# Altium schematic sheet Mega8515_flasher_v2.SchDoc
size 338 x 116 mm
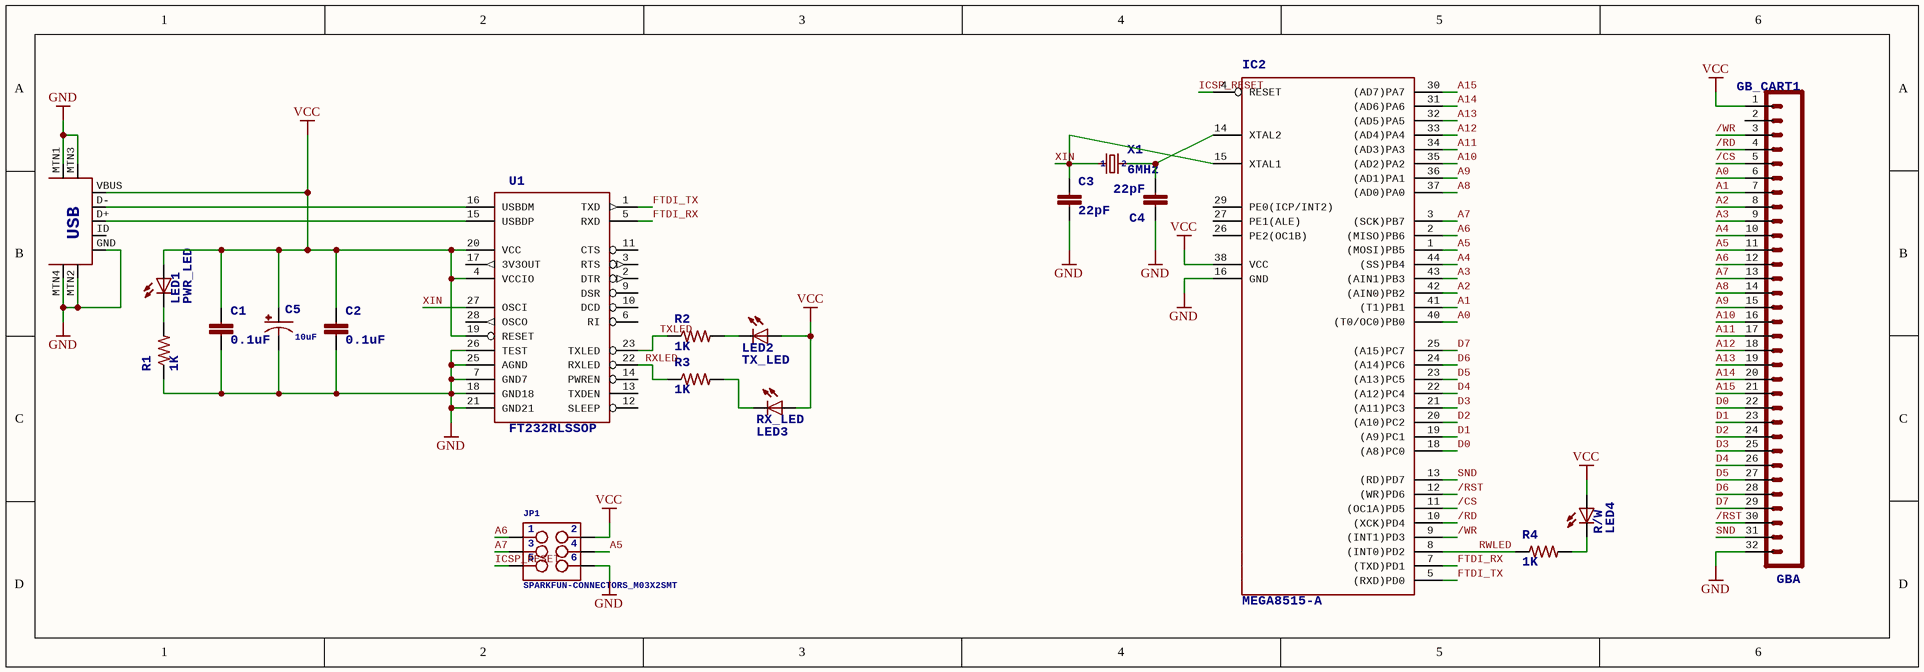
[diagram p0: Mega8515_flasher_v2.SchDoc]

## Parts
C1  >NAME: C1  [0805]  (hidden comment: 0.1uF)
C2  >NAME: C2  [0805]  (hidden comment: 0.1uF)
C3  >NAME: C3  [0805]  (hidden comment: 22pF)
C4  >NAME: C4  [0805]  (hidden comment: 22pF)
C5  >NAME: C5  [EIA3216]  (hidden comment: 10uF)
GBA  >NAME: GBA  [GB_CART_1]  (hidden comment: GB_CART1)
IC2  >NAME: IC2  [TQFP44]  (hidden comment: MEGA8515-A)
JP1  >NAME: JP1  [HDR2X3]  (hidden comment: SPARKFUN-CONNECTORS_M03X2SMT)
LED1  >NAME: LED1  [LED-1206]  (hidden comment: PWR_LED)
LED2  >NAME: LED2  [LED-1206]  (hidden comment: TX_LED)
R1  >NAME: R1  [0805]  (hidden comment: 1K)
R2  >NAME: R2  [0805]  (hidden comment: 1K)
R3  >NAME: R3  [0805]  (hidden comment: 1K)
R4  >NAME: R4  [0805]  (hidden comment: 1K)
R/W  >NAME: R/W  [LED-1206]  (hidden comment: LED4)
RX_LED  >NAME: RX_LED  [LED-1206]  (hidden comment: LED3)
U1  >NAME: U1  [SSOP28DB]  (hidden comment: FT232RLSSOP)
USB  USB-MINIB-5PIN  [USB-MINIB]  (value not drawn)
X1  >NAME: X1  [5032]  (hidden comment: 6MHz)

## Nets
GND: C1.2 C2.2 C3.2 C4.1 C5.C(-) GBA.32 IC2.16(GND) JP1.6 R1.1 U1.7(GND7) U1.18(GND18) U1.21(GND21) U1.25(AGND) U1.26(TEST) USB.GND USB.MTN1(MTN2) USB.MTN2(MTN3) USB.MTN3(MTN1) USB.MTN4
VCC: C1.1 C2.1 C5.A(+) GBA.1 IC2.38(VCC) JP1.2 LED1.A LED2.A R/W.A RX_LED.A U1.4(VCCIO) U1.19(RESET) U1.20(VCC) USB.VBUS
/CS: GBA.5 IC2.11((OC1A)PD5)
/RD: GBA.4 IC2.10((XCK)PD4)
/RST: GBA.30 IC2.12((WR)PD6)
/WR: GBA.3 IC2.9((INT1)PD3)
A0: GBA.6 IC2.40((T0/OC0)PB0)
A1: GBA.7 IC2.41((T1)PB1)
A2: GBA.8 IC2.42((AIN0)PB2)
A3: GBA.9 IC2.43((AIN1)PB3)
A4: GBA.10 IC2.44((SS)PB4)
A5: GBA.11 IC2.1((MOSI)PB5) JP1.4
A6: GBA.12 IC2.2((MISO)PB6) JP1.1
A7: GBA.13 IC2.3((SCK)PB7) JP1.3
A8: GBA.14 IC2.37((AD0)PA0)
A9: GBA.15 IC2.36((AD1)PA1)
A10: GBA.16 IC2.35((AD2)PA2)
A11: GBA.17 IC2.34((AD3)PA3)
A12: GBA.18 IC2.33((AD4)PA4)
A13: GBA.19 IC2.32((AD5)PA5)
A14: GBA.20 IC2.31((AD6)PA6)
A15: GBA.21 IC2.30((AD7)PA7)
D0: GBA.22 IC2.18((A8)PC0)
D1: GBA.23 IC2.19((A9)PC1)
D2: GBA.24 IC2.20((A10)PC2)
D3: GBA.25 IC2.21((A11)PC3)
D4: GBA.26 IC2.22((A12)PC4)
D5: GBA.27 IC2.23((A13)PC5)
D6: GBA.28 IC2.24((A14)PC6)
D7: GBA.29 IC2.25((A15)PC7)
FTDI_RX: IC2.7((TXD)PD1) U1.5(RXD)
FTDI_TX: IC2.5((RXD)PD0) U1.1(TXD)
ICSP_RESET: IC2.4(RESET) JP1.5
RWLED: IC2.8((INT0)PD2) R4.1
RXLED: R3.1 U1.22(RXLED)
SND: GBA.31 IC2.13((RD)PD7)
TXLED: R2.1 U1.23(TXLED)
XIN: C3.1 IC2.15(XTAL1) U1.27(OSCI) X1.1_4
NetC4_2: C4.2 IC2.14(XTAL2) X1.2_3
NetLED1_C: LED1.C R1.2
NetLED2_C: LED2.C R2.2
NetR3_2: R3.2 RX_LED.C
NetR4_2: R4.2 R/W.C
NetU1_15: U1.15(USBDP) USB.D+
NetU1_16: U1.16(USBDM) USB.D-

Not connected (* = marked no-connect by the designer): GBA 2; IC2 6(NC1) 17(NC2) 26(PE2(OC1B)) 27(PE1(ALE)) 28(NC3) 29(PE0(ICP/INT2)) 39(NC4); U1 2(DTR) 3(RTS) 6(RI) 9(DSR) 10(DCD) 11(CTS) 12(SLEEP) 13(TXDEN) 14(PWREN) 17(3V3OUT) 28(OSCO); USB ID

## Library data of the parts
C1 C2 = CAP1206: <b>Capacitor</b> / Standard 0603 ceramic capacitor, and 0.1" leaded capacitor.; >VALUE: 0.1uF
C3 C4 = CAP0805: <b>Capacitor</b> / Standard 0603 ceramic capacitor, and 0.1" leaded capacitor.; >VALUE: 22pF
C5 = 10UF-TANT: 10uF Tantalum SMT<br> / CAP-00811- 16V 10% (EIA-3216); PROD_ID: CAP-00811; VALUE: 10uF
IC2 = MEGA8515-A: <b>MICROCONTROLLER</b><p> / 8 Kbytes FLASH<br> / 512 bytes SRAM<br> / 512 bytes EEPROM<br> / USART<br> / 8-channel 10 bit ADC<p> / Source: avr.lbr; MPN: ATMEGA8515-16AU; OC_FARNELL: 9171410; OC_NEWARK: 01M6904; >VALUE: MEGA8515-A
JP1 = SPARKFUN-CONNECTORS_M03X2SMT: 2x3 .1" header.<br> / Shrouded, with keying- CONN-10681<br> / SMT- CONN-11415<br> / Pogo pins- HW-11044; PROD_ID: CONN-11415; >VALUE: SPARKFUN-CONNECTORS_M03X2SMT; 1: 1; 2: 2; 3: 3; 4: 4; 5: 5; 6: 6
LED1 LED2 R/W RX_LED = LED1206: <b>LEDs</b> / Standard schematic elements and footprints for 5mm, 3mm, 1206, and 0603 sized LEDs. 5mm - Spark Fun Electronics SKU : COM-00529 (and others)
  LED1: >VALUE: PWR_LED
  LED2: >VALUE: TX_LED
  R/W: >VALUE: LED4
  RX_LED: >VALUE: LED3
R1-R4 = RESISTOR1206: <b>Resistor</b> / Basic schematic elements and footprints for 0603, 1206, and PTH resistors.; >VALUE: 1K
U1 = FT232RLSSOP: <b>USB UART</b> / FT232RL 4<sup>th</sup> Generation USB UART (USB &lt;-&gt; Serial) Controller. <br> / Spark Fun Electronics SKU : COM-00650<br> / Production SKU IC-00870; PROD_ID: IC-00870; >VALUE: FT232RLSSOP
USB = USB-MINIB-5PIN: <b>Mini-USB "B" connector with 5th pin broken out.</b><p> / Created new symbol breaking out 5th "ID" pin in mini/micro USB connector spec.  See: http://en.wikipedia.org/wiki/Mini_usb#Cables.  Uses same footprint as 4-pin symbol.<p> / Also added pins to connect to mounting / shield pads if required (probably not generally needed as signals aren't shielded once they leave the connector).; USB: USB
X1 = SPARKFUN-FREQCTRL_CRYSTAL: Various standard crystals. Proven footprints. Spark Fun Electronics SKU : COM-00534; pin to pad: 1 4>1 2 3>2; >VALUE: 6MHz; 1: 1; 2: 2
GBA = GB_CART1: >VALUE: GB_CART1